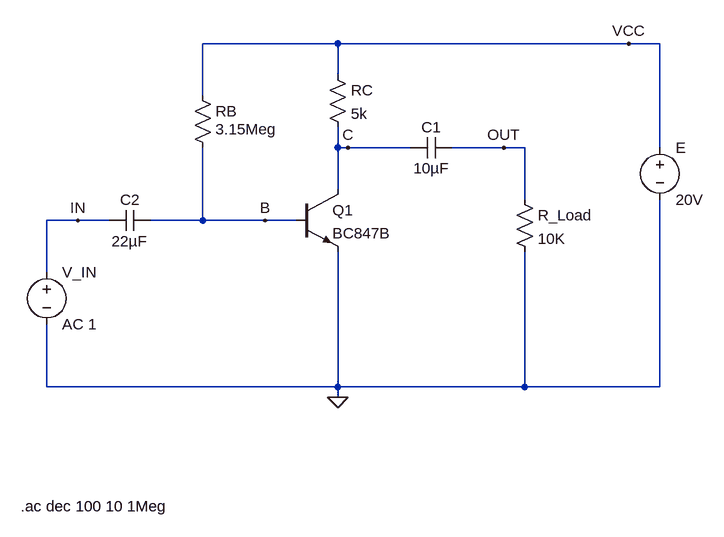
[diagram p0: schematic AEC_caracteristica de frecventa.asc]
AEC_caracteristica de frecventa.asc, the LTspice schematic file:
Version 4.1
SHEET 1 880 680
WIRE 208 -112 0 -112
WIRE 656 -112 208 -112
WIRE 704 -112 656 -112
WIRE 208 -64 208 -112
WIRE 0 -32 0 -112
WIRE 208 48 208 16
WIRE 224 48 208 48
WIRE 320 48 224 48
WIRE 464 48 384 48
WIRE 496 48 464 48
WIRE 704 48 704 -112
WIRE 208 112 208 48
WIRE 496 128 496 48
WIRE -192 160 -240 160
WIRE -144 160 -192 160
WIRE 0 160 0 48
WIRE 0 160 -80 160
WIRE 96 160 0 160
WIRE 144 160 96 160
WIRE -240 240 -240 160
WIRE -240 416 -240 320
WIRE 208 416 208 208
WIRE 208 416 -240 416
WIRE 496 416 496 208
WIRE 496 416 208 416
WIRE 704 416 704 128
WIRE 704 416 496 416
WIRE 208 432 208 416
FLAG 208 432 0
FLAG -192 160 IN
FLAG 464 48 OUT
FLAG 96 160 B
FLAG 656 -112 VCC
FLAG 224 48 C
SYMBOL npn 144 112 R0
SYMATTR InstName Q1
SYMATTR Value BC847B
SYMBOL cap 384 32 R90
WINDOW 0 0 32 VBottom 2
WINDOW 3 32 32 VTop 2
SYMATTR InstName C1
SYMATTR Value 10µF
SYMBOL res 480 112 R0
SYMATTR InstName R_Load
SYMATTR Value 10K
SYMBOL voltage -240 224 R0
WINDOW 123 0 0 Left 0
WINDOW 39 0 0 Left 0
SYMATTR InstName V_IN
SYMATTR Value AC 1
SYMBOL cap -80 144 R90
WINDOW 0 0 32 VBottom 2
WINDOW 3 32 32 VTop 2
SYMATTR InstName C2
SYMATTR Value 22µF
SYMBOL res -16 -48 R0
WINDOW 3 36 68 Left 2
SYMATTR InstName RB
SYMATTR Value 3.15Meg
SYMBOL res 192 -80 R0
SYMATTR InstName RC
SYMATTR Value 5k
SYMBOL voltage 704 32 R0
SYMATTR InstName E
SYMATTR Value 20V
TEXT -280 600 Left 2 !.ac dec 100 10 1Meg

The netlist it stands for:
* AEC_caracteristica de frecventa.asc
Q1 C B 0 0 BC847B
C1 OUT C 10µF
R_Load OUT 0 10K
V_IN IN 0 AC 1
C2 B IN 22µF
RB VCC B 3.15Meg
RC VCC C 5k
V§E VCC 0 20V
.model NPN NPN
.model PNP PNP
.lib standard.bjt
.ac dec 100 10 1Meg
.backanno
.end